# EAGLE design ShieldPotencia (EAGLE 7.2.0)
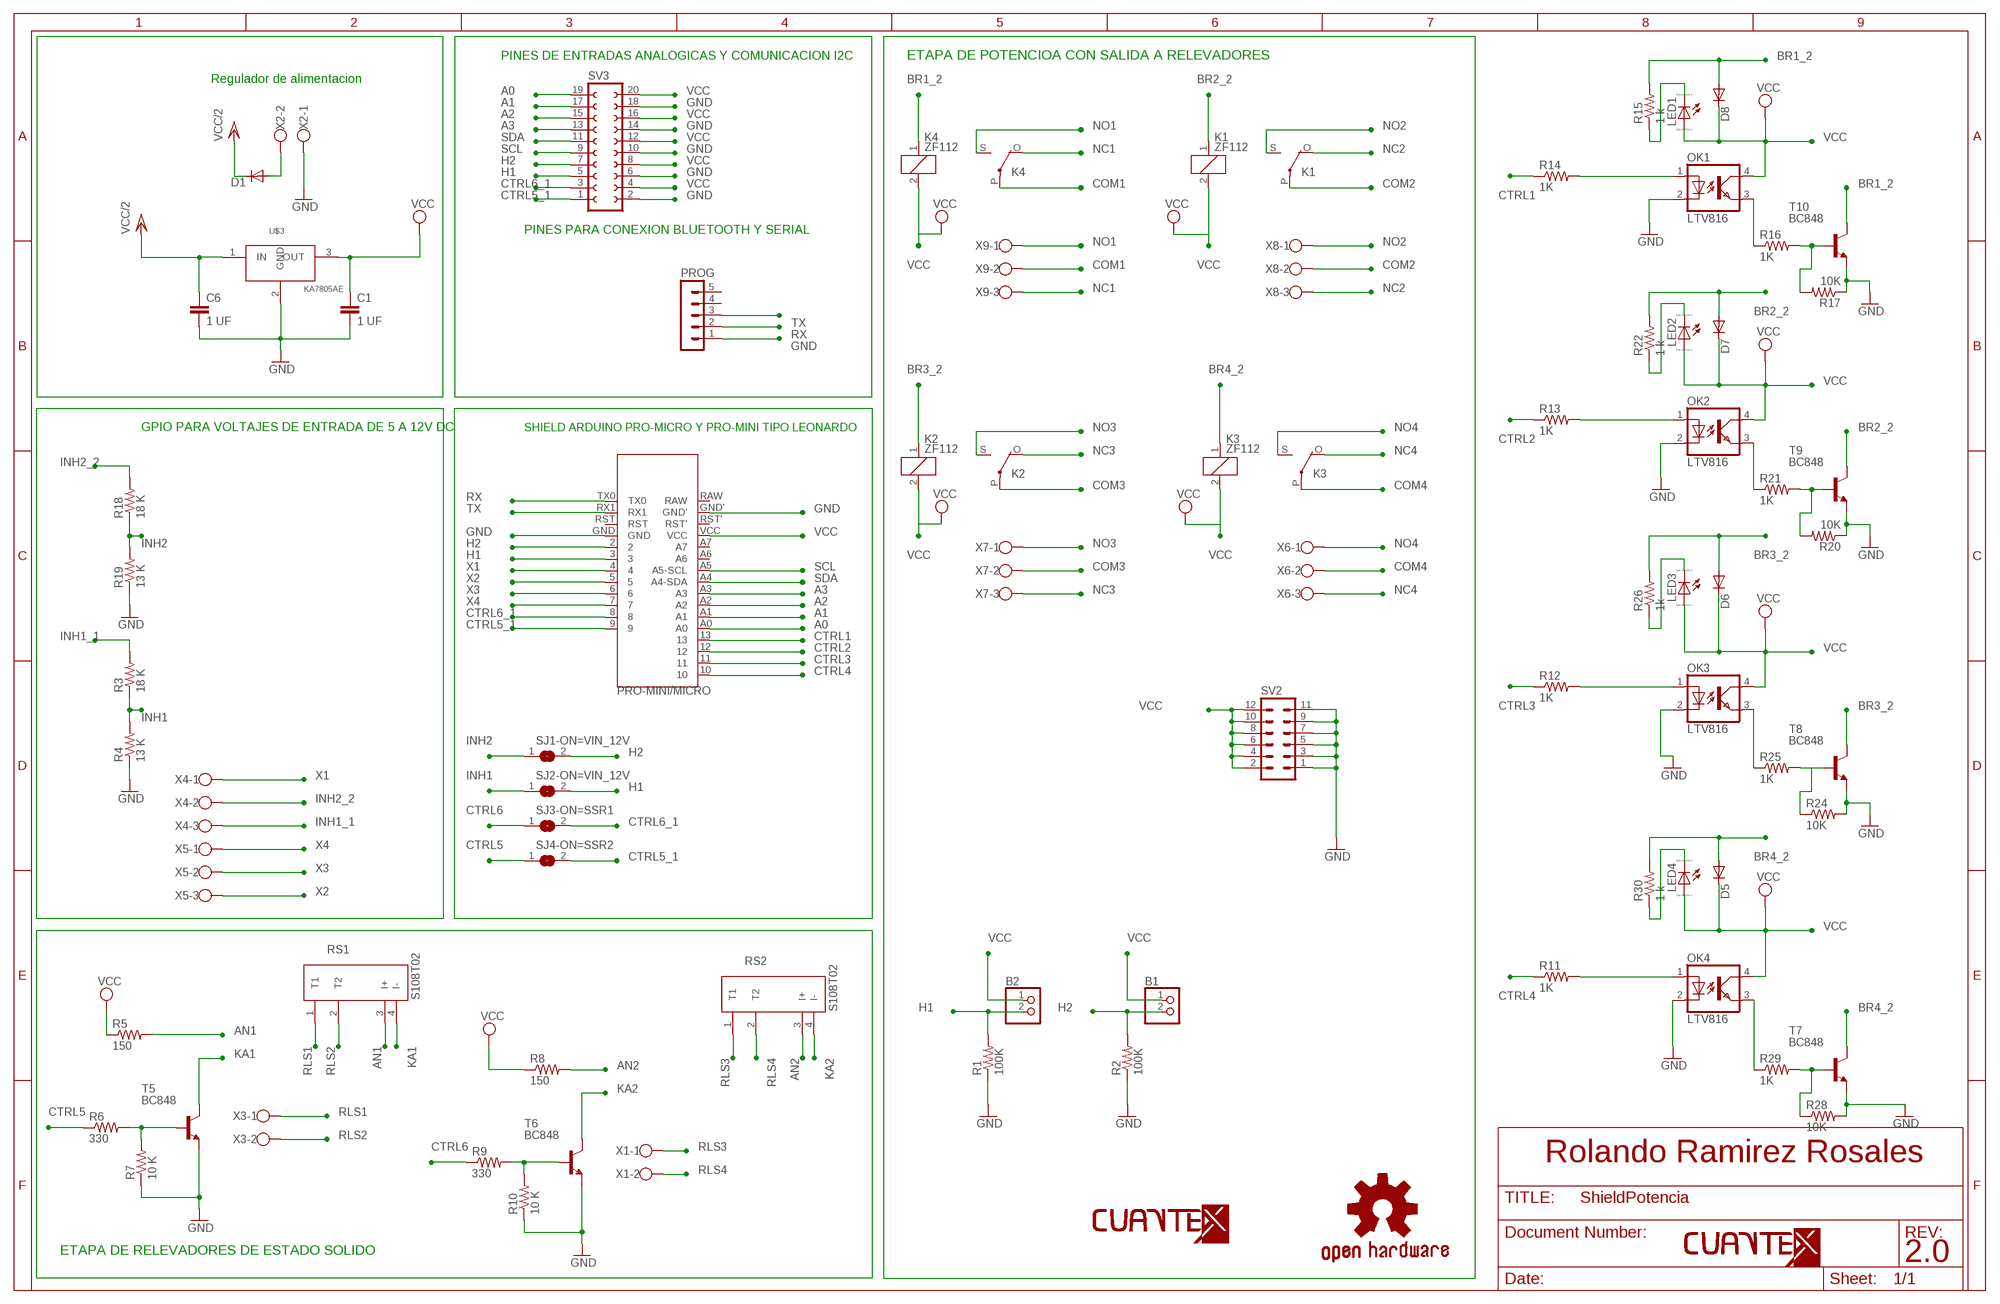
[diagram p0: schematic, sheet 1]

## Parts
B1  PINHD-1X2  [1X02]
B2  PINHD-1X2  [1X02]
C1  1 UF  C-EUC0603  [C0603]
C6  1 UF  C-EUC0603  [C0603]
D1  DIODE-SMB  [SMB]
D5  DIODE-SMB  [SMB]
D6  DIODE-SMB  [SMB]
D7  DIODE-SMB  [SMB]
D8  DIODE-SMB  [SMB]
GOLD_ORB_SM1  OSHWLOGO_GOLD_ORB_SM  [OSHW2]
K1  ZF112  [ZF112]
K2  ZF112  [ZF112]
K3  ZF112  [ZF112]
K4  ZF112  [ZF112]
LED1  LED_ESML0603  [LED_SML0603]
LED2  LED_ESML0603  [LED_SML0603]
LED3  LED_ESML0603  [LED_SML0603]
LED4  LED_ESML0603  [LED_SML0603]
OK1  LTV816  [DIL04]
OK2  LTV816  [DIL04]
OK3  LTV816  [DIL04]
OK4  LTV816  [DIL04]
PRO-MINI/MICRO  ARDUINO_PRO_MINI_V1  [ARDUINO_PRO_MINI_V1]
PROG  MA05-1  [MA05-1]
R1  100K  R-US_R0603  [R0603]
R2  100K  R-US_R0603  [R0603]
R3  18 K  R-US_R1206  [R1206]
R4  13 K  R-US_R1206  [R1206]
R5  150  R-US_R0603  [R0603]
R6  330  R-US_R0603  [R0603]
R7  10 K  R-US_R0603  [R0603]
R8  150  R-US_R0603  [R0603]
R9  330  R-US_R0603  [R0603]
R10  10 K  R-US_R0603  [R0603]
R11  1K  R-US_R0603  [R0603]
R12  1K  R-US_R0603  [R0603]
R13  1K  R-US_R0603  [R0603]
R14  1K  R-US_R0603  [R0603]
R15  1 k  R-US_R0603  [R0603]
R16  1K  R-US_R0603  [R0603]
R17  10K  R-US_R0603  [R0603]
R18  18 K  R-US_R1206  [R1206]
R19  13 K  R-US_R1206  [R1206]
R20  10K  R-US_R0603  [R0603]
R21  1K  R-US_R0603  [R0603]
R22  1 k  R-US_R0603  [R0603]
R24  10K  R-US_R0603  [R0603]
R25  1K  R-US_R0603  [R0603]
R26  1k  R-US_R0603  [R0603]
R28  10K  R-US_R0603  [R0603]
R29  1K  R-US_R0603  [R0603]
R30  1 k  R-US_R0603  [R0603]
RS1  S108T02  [SIP4PIN]
RS2  S108T02  [SIP4PIN]
SJ1-ON=VIN_12V  SJ  [SJ]
SJ2-ON=VIN_12V  SJ  [SJ]
SJ3-ON=SSR1  SJ  [SJ]
SJ4-ON=SSR2  SJ  [SJ]
SV2  MA06-2  [MA06-2]
SV3  FE10-2  [FE10-2]
T5  BC848  [SOT23]
T6  BC848  [SOT23]
T7  BC848  [SOT23]
T8  BC848  [SOT23]
T9  BC848  [SOT23]
T10  BC848  [SOT23]
U$1  LOGO-TOP-50MM  [C-3]
U$2  LOGO-TOP-20MM  [C-0]
U$3  KA7805AE  [DPAK]
X1  W237-102  [W237-102]
X2  W237-102  [W237-102]
X3  W237-102  [W237-102]
X4  W237-103  [W237-103]
X5  W237-103  [W237-103]
X6  W237-103  [W237-103]
X7  W237-103  [W237-103]
X8  W237-103  [W237-103]
X9  W237-103  [W237-103]

## Nets
A0: PRO-MINI/MICRO.A0 SV3.19
A1: PRO-MINI/MICRO.A1 SV3.17
A2: PRO-MINI/MICRO.A2 SV3.15
A3: PRO-MINI/MICRO.A3 SV3.13
AN1: R5.2 RS1.3(I+)
AN2: R8.2 RS2.3(I+)
BR1_2: D8.A K4.1 R15.2 T10.3(C)
BR2_2: D7.A K1.1 R22.2 T9.3(C)
BR3_2: D6.A K2.1 R26.2 T8.3(C)
BR4_2: D5.A K3.1 R30.2 T7.3(C)
COM1: K4.P(2:P) X9.2
COM2: K1.P(2:P) X8.2
COM3: K2.P(2:P) X7.2
COM4: K3.P(2:P) X6.2
CTRL1: PRO-MINI/MICRO.13 R14.1
CTRL2: PRO-MINI/MICRO.12 R13.1
CTRL3: PRO-MINI/MICRO.11 R12.1
CTRL4: PRO-MINI/MICRO.10 R11.1
CTRL5: R6.1 SJ4-ON=SSR2.1
CTRL5_1: PRO-MINI/MICRO.9 SJ4-ON=SSR2.2 SV3.1
CTRL6: R9.1 SJ3-ON=SSR1.1
CTRL6_1: PRO-MINI/MICRO.8 SJ3-ON=SSR1.2 SV3.3
GND: C1.2 C6.2 OK1.2(C) OK2.2(C) OK3.2(C) OK4.2(C) PRO-MINI/MICRO.GND PRO-MINI/MICRO.GND' PROG.1 R1.1 R2.1 R4.1 R7.1 R10.1 R17.1 R19.1 R20.1 R24.2 R28.2 SV2.1 SV2.3 SV2.5 SV2.7 SV2.9 SV2.11 SV3.2 SV3.6 SV3.10 SV3.14 SV3.18 T5.2(E) T6.2(E) T7.2(E) T8.2(E) T9.2(E) T10.2(E) U$3.2(GND) X2.1
H1: B2.2 PRO-MINI/MICRO.3 R1.2 SJ2-ON=VIN_12V.2 SV3.5
H2: B1.2 PRO-MINI/MICRO.2 R2.2 SJ1-ON=VIN_12V.2 SV3.7
INH1: R3.1 R4.2 SJ2-ON=VIN_12V.1
INH1_1: R3.2 X4.3
INH2: R18.1 R19.2 SJ1-ON=VIN_12V.1
INH2_2: R18.2 X4.2
KA1: RS1.4(I-) T5.3(C)
KA2: RS2.4(I-) T6.3(C)
N$4: OK2.1(A) R13.2
N$6: R9.2 R10.2 T6.1(B)
N$9: LED4.C R30.1
N$10: D1.A X2.2
N$12: OK4.1(A) R11.2
N$14: OK4.3(EMIT) R29.1
N$15: R28.1 R29.2 T7.1(B)
N$16: R24.1 R25.2 T8.1(B)
N$17: OK3.3(EMIT) R25.1
N$18: R20.2 R21.2 T9.1(B)
N$19: OK2.3(EMIT) R21.1
N$20: R16.2 R17.2 T10.1(B)
N$21: OK1.3(EMIT) R16.1
N$22: LED1.C R15.1
N$24: LED2.C R22.1
N$27: LED3.C R26.1
N$31: OK3.1(A) R12.2
N$43: OK1.1(A) R14.2
N$67: R6.2 R7.2 T5.1(B)
NC1: K4.O(2:O) X9.3
NC2: K1.O(2:O) X8.3
NC3: K2.O(2:O) X7.3
NC4: K3.O(2:O) X6.3
NO1: K4.S(2:S) X9.1
NO2: K1.S(2:S) X8.1
NO3: K2.S(2:S) X7.1
NO4: K3.S(2:S) X6.1
RLS1: RS1.1(T1) X3.1
RLS2: RS1.2(T2) X3.2
RLS3: RS2.1(T1) X1.1
RLS4: RS2.2(T2) X1.2
RX: PRO-MINI/MICRO.TX0 PROG.2
SCL: PRO-MINI/MICRO.A5(A5-SCL) SV3.9
SDA: PRO-MINI/MICRO.A4(A4-SDA) SV3.11
TX: PRO-MINI/MICRO.RX1 PROG.3
VCC: B1.1 B2.1 C1.1 D5.C D6.C D7.C D8.C K1.2 K2.2 K3.2 K4.2 LED1.A LED2.A LED3.A LED4.A OK1.4(COL) OK2.4(COL) OK3.4(COL) OK4.4(COL) PRO-MINI/MICRO.VCC R5.1 R8.1 SV2.2 SV2.4 SV2.6 SV2.8 SV2.10 SV2.12 SV3.4 SV3.8 SV3.12 SV3.16 SV3.20 U$3.3(OUT)
VCC/2: C6.1 D1.C U$3.1(IN)
X1: PRO-MINI/MICRO.4 X4.1
X2: PRO-MINI/MICRO.5 X5.3
X3: PRO-MINI/MICRO.6 X5.2
X4: PRO-MINI/MICRO.7 X5.1
Unconnected: PRO-MINI/MICRO.A6 PRO-MINI/MICRO.A7 PRO-MINI/MICRO.RAW PRO-MINI/MICRO.RST PRO-MINI/MICRO.RST' PROG.4 PROG.5

## Notes on the sheet
- PINES DE ENTRADAS ANALOGICAS Y COMUNICACION I2C | ETAPA DE POTENCIOA CON SALIDA A RELEVADORES
- Regulador de alimentacion
- PINES PARA CONEXION BLUETOOTH Y SERIAL
- GPIO PARA VOLTAJES DE ENTRADA DE 5 A 12V DC | SHIELD ARDUINO PRO-MICRO Y PRO-MINI TIPO LEONARDO
- Rolando Ramirez Rosales
- ETAPA DE RELEVADORES DE ESTADO SOLIDO
- 2.0

## Library data of the parts
B1 B2 = pinhead:PINHD-1X2: PIN HEADER
C1 C6 = rcl:C-EU: CAPACITOR, European symbol
D1 D5-D8 = diode:DIODE-: DIODE
GOLD_ORB_SM1 = OPENHW:OSHWLOGO: These are Open-Source Hardware logos.
K1-K4 = relay:ZF112: RELAY 1 x switch; OC_FARNELL: unknown; OC_NEWARK: unknown
LED1-LED4 = eagle-ltspice:LED_E: LED Source: http://www.osram.convergy.de Source: www.luxeon.com Source: www.kingbright.com; SPICEMODEL: NONE; SPICEPREFIX: D; SPICETYPE: diode
OK1-OK4 = optocoupler:LTV816: OPTO COUPLER Source: LITEON, LTV816.pdf; OC_FARNELL: unknown; OC_NEWARK: unknown
PRO-MINI/MICRO = Arduino_Pro_Mini:ARDUINO_PRO_MINI_V1
PROG = con-lstb:MA05-1: PIN HEADER; OC_FARNELL: unknown; OC_NEWARK: unknown
R1-R22 R24-R26 R28-R30 = rcl:R-US_: RESISTOR, American symbol
RS1 RS2 = SSRHETPRO:S108T02
SJ1-ON=VIN_12V SJ2-ON=VIN_12V SJ3-ON=SSR1 SJ4-ON=SSR2 = jumper:SJ: SMD solder JUMPER
SV2 = con-lstb:MA06-2: PIN HEADER; OC_FARNELL: unknown; OC_NEWARK: unknown
SV3 = con-lsta:FE10-2: FEMALE HEADER; OC_FARNELL: unknown; OC_NEWARK: unknown
T5-T10 = transistor-neu-to92:BC848: NPN TRANSISTOR
U$1 = LOGOTIPOS:LOGO-TOP-50MM
U$2 = LOGOTIPOS:LOGO-TOP-20MM
U$3 = Regulador5VKA7805AE:KA7805AE: Regulador de voltaje 5V ing.roland.ramirez@gmail.com
X1-X3 = con-wago-500:W237-102: WAGO SCREW CLAMP; MPN: 237-102; OC_FARNELL: unknown; OC_NEWARK: 70K9898
X4-X9 = con-wago-500:W237-103: WAGO SCREW CLAMP; MPN: 237-103; OC_FARNELL: unknown; OC_NEWARK: 18M7116

## Board
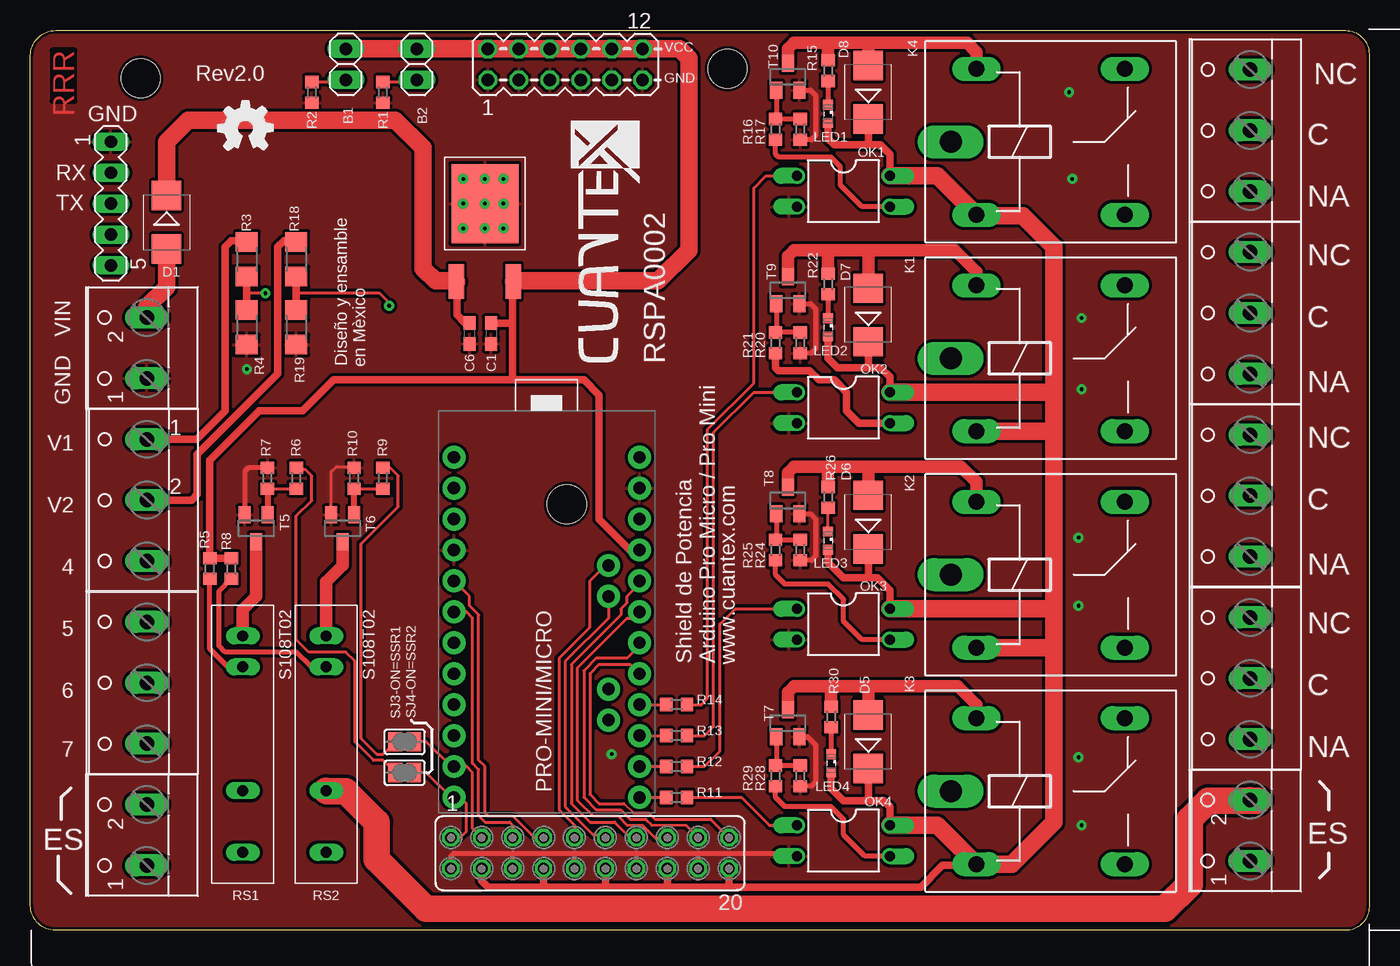
[diagram p1: board, top side]
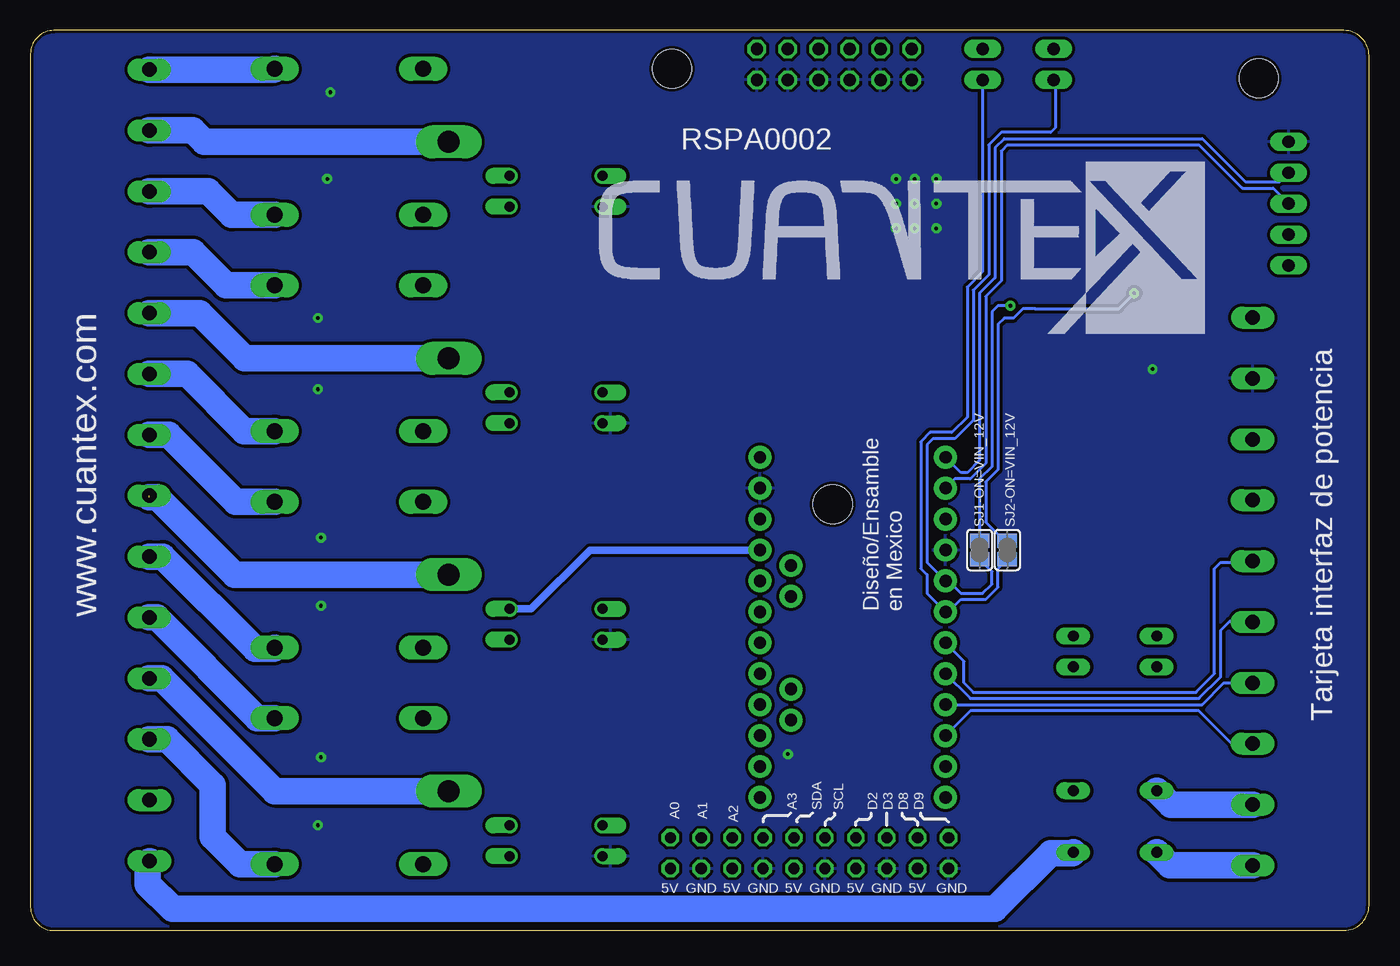
[diagram p2: board, bottom side, seen from below]

Size 109.98 x 73.91 mm. Coordinates in mm from the lower left corner, seen from the top.
Outline: 108.06,0 2.06,0 arc-90 0,2.06 0,71.85 arc-90 2.07,73.91 108.06,73.91 arc-90 109.98,71.99 109.98,1.92 arc-90 108.06,0
Copper layers (1*16): Top 0.035mm / dielectric 1.5mm / Bottom 0.035mm
Design rules "cuantex2layerdrc": minimum track width 8mil, minimum drill 0.3mm, track to track 8mil, track to pad 8mil, pad to pad 8mil, via to via 8mil, smd to smd 0mil, copper to edge 10mil, drill to drill 10mil, minimum pad ring 10mil, minimum via ring 10mil, stop-mask expansion 4mil, vias tented up to drill 0mil, thermal gap 10mil
Holes 3.2 mm at 9.06,70 57.27,70.76 44.06,35

### Footprints (pad centres in the part's own frame; a part is rotated, then mirrored left to right if it is on the bottom)
1X02 = drill 1.016 long: 1 -1.27,0; 2 1.27,0
C0603 = smd 1.1 x 1: 1 -0.85,0; 2 0.85,0
SMB = smd 2.4 x 2.4: A 2.2,0; C -2.2,0
ZF112 = drill 1.321 long: 1 -6.096,5.994; 2 -6.096,-5.994; O 6.096,5.994; S 6.096,-5.994 | drill 1.803 long: P -8.204,0
LED_SML0603 = smd 0.8 x 0.8: A 0.75,0; C -0.75,0
DIL04 = drill 0.813 offset: 1 -1.27,-3.81; 2 1.27,-3.81; 3 1.27,3.81; 4 -1.27,3.81
ARDUINO_PRO_MINI_V1 = drill 1.016 pad 1.88: 2 -7.62,2.54; 3 -7.62,0; 4 -7.62,-2.54; 5 -7.62,-5.08; 6 -7.62,-7.62; 7 -7.62,-10.16; 8 -7.62,-12.7; 9 -7.62,-15.24; 10 7.62,-15.24; 11 7.62,-12.7; 12 7.62,-10.16; 13 7.62,-7.62; A0 7.62,-5.08; A1 7.62,-2.54; A2 7.62,0; A3 7.62,2.54; A4 5.08,1.27; A5 5.08,3.81; A6 5.08,-8.89; A7 5.08,-6.35; GND -7.62,5.08; GND' 7.62,10.16; RAW 7.62,12.7; RST -7.62,7.62; RST' 7.62,7.62; RX1 -7.62,10.16; TX0 -7.62,12.7; VCC 7.62,5.08
MA05-1 = drill 1.016 long: 1 -5.08,0; 2 -2.54,0; 3 0,0; 4 2.54,0; 5 5.08,0
R0603 = smd 1 x 1.1: 1 -0.85,0; 2 0.85,0
R1206 = smd 1.6 x 1.803: 1 -1.422,0; 2 1.422,0
SIP4PIN = drill 0.9 long: 1 -10.16,0; 2 -5.08,0; 3 5.08,0; 4 7.62,0
SJ = smd 1.168 x 1.6: 1 -0.762,0; 2 0.762,0
MA06-2 = drill 1.016 octagon: 1 -6.35,-1.27; 2 -6.35,1.27; 3 -3.81,-1.27; 4 -3.81,1.27; 5 -1.27,-1.27; 6 -1.27,1.27; 7 1.27,-1.27; 8 1.27,1.27; 9 3.81,-1.27; 10 3.81,1.27; 11 6.35,-1.27; 12 6.35,1.27
FE10-2 = drill 0.914 octagon: 1 -11.43,1.27; 2 -11.43,-1.27; 3 -8.89,1.27; 4 -8.89,-1.27; 5 -6.35,1.27; 6 -6.35,-1.27; 7 -3.81,1.27; 8 -3.81,-1.27; 9 -1.27,1.27; 10 -1.27,-1.27; 11 1.27,1.27; 12 1.27,-1.27; 13 3.81,1.27; 14 3.81,-1.27; 15 6.35,1.27; 16 6.35,-1.27; 17 8.89,1.27; 18 8.89,-1.27; 19 11.43,1.27; 20 11.43,-1.27
SOT23 = smd 1 x 1.4: 1 -0.95,-1.1; 2 0.95,-1.1; 3 0,1.1
DPAK = smd 1.25 x 2.85: 1 -2.34,-6.4; 3 2.34,-6.4 | smd 5.5 x 6.5: 2 0,0
W237-102 = drill 1.194 long: 1 -2.5,-1.27; 2 2.5,-1.27
W237-103 = drill 1.194 long: 1 -5,-1.29; 2 0,-1.29; 3 5,-1.29

### Placement (x,y rotation side)
B1  25.91,71.12 270 top
B2  31.75,71.12 270 top
C1  37.85,49.02 270 top
C6  36.07,49.02 270 top
D1  11.18,58.17 270 top
D5  68.83,15.49 90 top
D6  68.83,33.53 90 top
D7  68.83,50.55 90 top
D8  68.83,68.83 90 top
GOLD_ORB_SM1  13.84,61.59 0 top
K1  83.82,46.99 0 top
K2  83.82,29.21 0 top
K3  83.82,11.43 0 top
K4  83.82,64.77 0 top
LED1  65.53,67.06 270 top
LED2  65.53,49.53 270 top
LED3  65.53,32 270 top
LED4  65.79,13.72 270 top
OK1  66.8,60.71 270 top
OK2  66.8,42.93 270 top
OK3  66.8,25.15 270 top
OK4  66.8,7.37 270 top
PRO-MINI/MICRO  42.42,26.16 0 top
PROG  6.6,59.69 270 top
R1  28.96,68.83 90 top
R2  23.11,68.83 90 top
R3  17.78,55.12 90 top
R4  17.78,49.53 90 top
R5  14.73,29.72 270 top
R6  21.84,37.13 270 top
R7  19.48,37.13 270 top
R8  16.51,29.72 270 top
R9  28.96,37.13 270 top
R10  26.59,37.13 270 top
R11  53.09,10.92 0 top
R12  53.09,13.46 0 top
R13  53.09,16 0 top
R14  53.09,18.54 0 top
R15  65.53,70.61 90 top
R16  61.21,65.79 90 top
R17  63.25,65.79 90 top
R18  21.84,55.12 90 top
R19  21.84,49.53 90 top
R20  63.25,48.26 90 top
R21  61.21,48.26 90 top
R22  65.53,53.09 90 top
R24  63.25,31.24 270 top
R25  61.21,31.24 90 top
R26  65.53,35.56 90 top
R28  63.25,12.7 270 top
R29  61.21,12.7 90 top
R30  65.79,17.53 90 top
RS1  17.45,16.56 90 top
RS2  24.31,16.56 90 top
SJ1-ON=VIN_12V  32,31.24 270 bottom
SJ2-ON=VIN_12V  29.72,31.24 270 bottom
SJ3-ON=SSR1  30.73,15.49 0 top
SJ4-ON=SSR2  30.73,12.95 0 top
SV2  43.94,71.12 0 top
SV3  45.97,6.35 0 top
T5  18.54,33.02 180 top
T6  25.65,33.02 180 top
T7  62.23,17.02 0 top
T8  62.23,35.31 0 top
T9  62.23,52.58 0 top
T10  62.23,70.1 0 top
U$1  63.37,48.9 0 bottom
U$2  50.09,46.61 90 top
U$3  37.34,59.69 0 top
X1  98.93,8.2 90 top
X2  8.29,47.83 90 top
X3  8.29,7.83 90 top
X4  8.29,35.33 90 top
X5  8.29,20.33 90 top
X6  98.93,20.7 90 top
X7  98.93,35.7 90 top
X8  98.93,50.7 90 top
X9  98.93,65.7 90 top

### Tracks (layer width: path | path; a pad name or v marks a point on that pad's centre or on a via)
A0
  Top 0.203: 48.77,10.41 49.53,9.65
  Top 0.254: PRO-MINI/MICRO.A0 49.28,21.84 46.74,21.84 45.97,21.08 45.97,11.18 46.74,10.41 48.77,10.41 | 49.53,9.65 50.8,9.65 51.31,9.14 55.88,9.14 SV3.19
A1
  Top 0.203: 51.05,8.64 53.85,8.64
  Top 0.254: PRO-MINI/MICRO.A1 50.04,23.37 49.02,22.35 46.48,22.35 45.47,21.34 45.47,10.92 46.48,9.91 48.51,9.91 49.28,9.14 50.55,9.14 51.05,8.64 | 53.85,8.64 SV3.17
A2
  Top 0.203: 49.02,8.64 50.29,8.64
  Top 0.254: PRO-MINI/MICRO.A2 49.53,25.65 49.02,25.65 44.96,21.59 44.96,10.67 46.23,9.4 48.26,9.4 49.02,8.64 | 50.29,8.64 51.31,7.62 SV3.15
A3
  Top 0.254: PRO-MINI/MICRO.A3 50.04,28.45 49.02,27.43 49.02,26.92 48.51,26.42 48.51,25.91 44.45,21.84 44.45,10.41 45.97,8.89 48.01,8.89 49.02,7.87 49.53,7.87 SV3.13
AN1
  Top 0.406: RS1.3 16.2,21.64 14.73,23.11 R5.2
AN2
  Top 0.406: RS2.3 23.06,21.64 21.84,22.86 16,22.86 15.49,23.37 15.49,27.85 R8.2
BR1_2
  Top 1.016: K4.1 77.72,72.14 76.96,72.9 68.58,72.9 | 68.58,72.9 65.53,72.9 | 65.53,72.9 62.74,72.9 62.23,72.39 T10.3 | D8.A 68.83,72.64 68.58,72.9 | R15.2 65.53,72.9
BR2_2
  Top 1.016: K1.1 77.72,54.1 75.95,55.88 69.09,55.88 | 69.09,55.88 65.79,55.88 | 65.79,55.88 62.74,55.88 62.23,55.37 T9.3 | D7.A 68.83,55.63 69.09,55.88 | R22.2 65.53,55.63 65.79,55.88
BR3_2
  Top 1.016: K2.1 77.72,36.83 76.45,38.1 68.58,38.1 | 68.58,38.1 65.53,38.1 | 65.53,38.1 62.74,38.1 62.23,37.59 T8.3 | R26.2 65.53,38.1 | D6.A 68.83,37.85 68.58,38.1
BR4_2
  Top 1.016: K3.1 77.72,18.54 76.2,20.07 68.83,20.07 | 68.83,20.07 66.04,20.07 | 66.04,20.07 62.74,20.07 62.23,19.56 T7.3 | R30.2 65.79,19.81 66.04,20.07 | D5.A 68.83,20.07
COM1
  Bottom 2.184: K4.P 95.71,64.77 96.65,65.71 100.21,65.71 X9.2
COM2
  Bottom 2.184: K1.P 92.38,46.99 96.09,50.7 X8.2
COM3  (1 unrouted)
  Bottom 2.184: 100.22,35.56 99.57,35.56 93.22,29.21 K2.P
COM4
  Bottom 2.184: X6.2 99.19,20.7 89.92,11.43 K3.P
CTRL1
  Top 0.254: PRO-MINI/MICRO.13 R14.1
CTRL2
  Top 0.254: PRO-MINI/MICRO.12 R13.1
CTRL3
  Top 0.254: PRO-MINI/MICRO.11 R12.1
CTRL4
  Top 0.254: PRO-MINI/MICRO.10 R11.1
CTRL5
  Top 0.254: 21.86,38 R6.1 21.98,37.85 22.61,37.85 23.11,37.34 23.11,35.31 21.84,34.04 21.84,23.88 22.86,22.86 25.91,22.86 26.67,22.1 26.67,15.49 28.19,13.97 28.96,13.97 SJ4-ON=SSR2.1
CTRL5_1
  Top 0.254: SJ4-ON=SSR2.2 32.51,12.95 34.54,10.92 PRO-MINI/MICRO.9 35.31,10.92 35.81,10.41 35.81,8.13 35.31,7.62 SV3.1
CTRL6
  Top 0.254: 28.97,38 R9.1 29.07,38.1 29.46,38.1 30.23,37.34 30.23,34.8 27.18,31.75 27.18,15.75 28.45,14.48 28.96,14.48 SJ3-ON=SSR1.1
CTRL6_1
  Top 0.254: SJ3-ON=SSR1.2 32.51,15.49 34.54,13.46 PRO-MINI/MICRO.8 35.81,13.46 36.32,12.95 36.32,8.38 SV3.3
GND  (via drill 0.3)
  Top 0.254: T6.2 24.7,37.66 25.15,38.1 26.48,38.1 R10.1
  Top 0.406: R7.1 17.89,37.98 17.6,37.69 T5.2 | T10.2 64.09,69 64.52,68.58 64.52,65.28 64.17,64.94 R17.1 | T9.2 64.09,51.48 64.52,51.05 64.52,47.75 64.17,47.41 R20.1 | T8.2 64.09,34.21 64.52,33.78 64.52,30.73 64.17,30.39 R24.2 | T7.2 63.84,15.92 64.52,15.24 64.52,12.19 64.17,11.85 R28.2 | SV3.2 34.54,6.1 34.8,6.35 39.62,6.35 | 39.62,6.35 44.7,6.35 | 44.7,6.35 49.78,6.35 | 49.78,6.35 54.86,6.35 | 54.86,6.35 62.74,6.35 OK4.2 | SV3.6 39.62,6.35 | SV3.10 44.7,6.35 | SV3.14 49.78,6.35 | SV3.18 54.86,6.35
  other vias: 35.56,61.72 35.56,59.69 35.56,57.66 38.86,61.72 38.86,59.69 38.86,57.66 37.34,61.72 37.34,59.69 37.34,57.66 17.78,46.1 86.11,32.26 86.11,26.67 86.11,14.22 86.36,8.64 86.36,44.45 86.36,50.29 85.6,61.72 85.34,68.83 47.75,14.48
  pour Bottom (isolate 0.254): 0.06,74 109.94,74.25 109.94,0.25 0.06,0
  pour Top (isolate 0.254): 0.06,0 0.06,74 109.94,74 109.94,0
H1
  Top 0.254: PRO-MINI/MICRO.3 35.81,26.16 36.32,25.65 36.32,13.72 36.83,13.21 36.83,9.4 37.34,8.89 39.37,8.89 39.62,8.64 SV3.5 | R1.2 31.58,69.68 B2.2
  Bottom 0.254: SJ2-ON=VIN_12V.2 30.48,29.72 30.48,28.19 31.5,27.18 33.53,27.18 34.54,26.16 PRO-MINI/MICRO.3 36.32,27.69 36.32,29.21 36.83,29.72 36.83,40.13 36.07,40.89 34.29,40.89 33.02,42.16 33.02,52.83 31.75,54.1 B2.2
H2
  Top 0.254: PRO-MINI/MICRO.2 36.07,27.43 36.07,26.67 36.83,25.91 36.83,13.97 37.34,13.46 37.34,9.65 37.59,9.4 39.62,9.4 41.4,7.62 SV3.7 | R2.2 25.74,69.68 B1.2
  Bottom 0.254: SJ1-ON=VIN_12V.2 30.99,29.46 30.99,28.45 31.75,27.69 33.53,27.69 34.54,28.7 PRO-MINI/MICRO.2 36.32,30.23 36.32,39.88 35.81,40.39 34.04,40.39 32.51,41.91 32.51,52.58 31.24,53.85 31.24,64.52 30.23,65.53 26.16,65.53 25.74,65.95 25.74,69.68 B1.2
INH1  (via drill 0.3)
  Top 0.254: v19.3,52.32 17.78,52.32
  Top 0.61: R4.2 17.78,52.32 R3.1
  Bottom 0.254: SJ2-ON=VIN_12V.1 29.97,32.26 30.23,32.26 31.5,33.53 31.5,36.83 30.48,37.85 30.48,49.78 29.97,50.29 29.21,50.29 28.45,51.05 27.43,51.05 20.57,51.05 v19.3,52.32
INH1_1
  Top 0.61: X4.3 13.66,40.33 16,42.67 16,56.13 16.51,56.64 17.68,56.64 R3.2
INH2  (via drill 0.3)
  Top 0.254: v29.46,51.31 29.46,51.56 28.7,52.32 21.84,52.32
  Top 0.61: R19.2 21.84,52.32 R18.1
  Bottom 0.254: v29.46,51.31 30.48,51.31 30.99,50.8 30.99,38.1 32,37.08 SJ1-ON=VIN_12V.1
INH2_2
  Top 0.61: X4.2 13.24,35.33 13.72,35.81 13.72,39.12 20.32,45.72 20.32,56.13 20.83,56.64 21.74,56.64 R18.2
KA1
  Top 1.016: RS1.4 17.45,26.34 18.54,27.43 T5.3
KA2
  Top 1.016: RS2.4 24.31,28.63 25.65,29.97 T6.3
N$4
  Top 0.254: R13.2 55.37,16 56.13,16.76 56.13,40.89 59.44,44.2 OK2.1
N$6
  Top 0.254: R10.2 R9.2
  Top 0.508: T6.1 R10.2
N$9
  Top 0.406: R30.1 LED4.C
N$10
  Top 1.422: X2.2 9.56,51.21 11.18,52.83 D1.A
N$12
  Top 0.254: R11.2 58.42,10.92 60.71,8.64 OK4.1
N$14
  Top 0.406: OK4.3 68.58,6.1 66.8,7.87 66.8,9.14 65.79,10.16 61.98,10.16 61.21,10.92 R29.1
N$15
  Top 0.406: T7.1 61.28,13.62 R29.2 R28.1
N$16
  Top 0.406: T8.1 61.28,32.16 R25.2 R24.1
N$17
  Top 0.406: OK3.3 68.33,23.88 66.8,25.4 66.8,27.18 65.53,28.45 61.98,28.45 61.21,29.21 R25.1
N$18
  Top 0.406: T9.1 61.28,49.18 R21.2 R20.2
N$19
  Top 0.61: OK2.3 68.07,41.66 67.06,42.67 67.06,44.2 66.04,45.21 64.77,45.21 64.01,45.97 61.47,45.97 61.21,46.23 R21.1 61.21,47.5
N$20
  Top 0.406: T10.1 61.28,66.7 R16.2 R17.2
N$21
  Top 0.406: OK1.3 68.33,59.44 66.55,61.21 66.55,62.74 65.79,63.5 61.47,63.5 61.21,63.75 R16.1
N$22
  Top 0.406: R15.1 LED1.C
N$24
  Top 0.406: R22.1 LED2.C
N$27
  Top 0.254: LED3.C R26.1
N$31
  Top 0.254: R12.2 55.37,13.46 56.64,14.73 56.64,25.15 57.91,26.42 OK3.1
N$43
  Top 0.254: R14.2 55.12,18.54 55.63,19.05 55.63,41.15 59.44,44.96 59.44,60.96 60.45,61.98 OK1.1
N$67
  Top 0.254: R7.2 R6.2
  Top 0.508: R7.2 19.48,34.13 T5.1
NC1
  Bottom 2.184: X9.3 89.98,70.7 K4.O
NC2
  Bottom 2.184: K1.O 93.9,52.98 96.62,55.7 X8.3
NC3
  Bottom 2.184: X7.3 98.61,40.7 93.12,35.2 K2.O
NC4
  Bottom 2.184: X6.3 99.61,25.7 91.34,17.42 K3.O
NO1
  Bottom 2.184: K4.S 93.45,58.78 95.38,60.71 X9.1
NO2
  Bottom 2.184: X8.1 97.11,45.7 92.41,41 K1.S
NO3
  Bottom 2.184: X7.1 99.1,30.7 91.52,23.11 90.02,23.11 K2.S
NO4
  Bottom 2.184: X6.1 98.76,15.7 95,11.94 95,7.7 92.74,5.44 K3.S
RLS1
  Bottom 2.184: X3.1 16.38,5.33 RS1.1
RLS2
  Bottom 2.184: X3.2 16.3,10.33 RS1.2
RLS3
  Bottom 2.184: RS2.1 24.36,6.35 26.16,6.35 30.73,1.78 98.3,1.78 100.33,3.81 100.33,5.57 X1.1
RLS4
  Top 2.184: RS2.2 24.36,11.43 25.91,11.43 28.45,8.89 28.45,5.84 32.51,1.78 93.22,1.78 95.25,3.81 95.25,9.14 96.77,10.67 100.23,10.67 | 100.84,10.67 100.23,10.67 | 100.23,10.67 X1.2
RX
  Bottom 0.254: PRO-MINI/MICRO.TX0 33.53,37.59 33.02,37.59 32,38.61 32,52.32 30.73,53.59 30.73,64.26 29.97,65.02 13.72,65.02 10.16,61.47 7.37,61.47 PROG.2
SCL
  Top 0.254: PRO-MINI/MICRO.A5 47.24,29.97 45.97,28.7 45.97,24.89 43.43,22.35 43.43,9.91 44.7,8.64 SV3.9
SDA
  Top 0.254: PRO-MINI/MICRO.A4 47.5,25.65 43.94,22.1 43.94,10.16 46.23,7.87 46.99,7.87 SV3.11
TX
  Bottom 0.254: PRO-MINI/MICRO.RX1 34.04,37.08 32.77,37.08 31.5,38.35 31.5,52.07 30.23,53.34 30.23,64.01 29.72,64.52 13.97,64.52 10.41,60.96 7.87,60.96 PROG.3
VCC
  Top 0.61: 39.62,45.21 39.62,50.04 | 39.62,50.04 39.62,53.24 U$3.3 | C1.1 39.46,49.87 39.62,50.04 | LED1.A 65.53,65.02 66.04,64.52 68.83,64.52 | 68.83,64.52 69.85,64.52 70.61,63.75 OK1.4 | D8.C 68.83,64.52 | LED2.A 65.53,46.99 66.29,46.23 68.83,46.23 | 68.83,46.23 69.85,46.23 70.61,45.47 OK2.4 | D7.C 68.83,46.23 | LED3.A 65.53,30.23 66.8,28.96 68.83,28.96 | 68.83,28.96 69.6,28.96 70.61,27.94 OK3.4 | D6.C 68.83,28.96 | LED4.A 65.79,11.68 66.8,10.67 68.83,10.67 | 68.83,10.67 70.1,10.67 70.61,10.16 OK4.4 | D5.C 68.83,10.67 | R8.1 R5.1 14.73,38.61 18.8,42.67 22.35,42.67 24.89,45.21 39.62,45.21 | PRO-MINI/MICRO.VCC 49.28,31.24 46.74,33.78 46.74,43.94 45.47,45.21 39.62,45.21 | SV3.4 37.08,4.06 37.59,3.56 42.16,3.56 | 42.16,3.56 47.24,3.56 | 47.24,3.56 52.32,3.56 | 52.32,3.56 57.4,3.56 | 57.4,3.56 73.15,3.56 74.93,5.33 77.62,5.33 K3.2 | SV3.8 42.16,3.56 | SV3.20 57.4,3.56 | SV3.16 52.32,3.56 | SV3.12 47.24,3.56
  Top 1.422: 84.07,23.37 84.07,8.89 80.62,5.44 K3.2 74.52,8.64 OK4.4 | 84.07,23.37 84.07,26.67 | 84.07,26.67 84.07,40.89 | 84.07,40.89 84.07,44.2 | 84.07,44.2 84.07,56.13 81.53,58.67 77.83,58.67 K4.2 74.52,61.98 OK1.4 | OK2.4 84.07,44.2 | K1.2 83.97,41 84.07,40.89 | K2.2 83.92,23.22 84.07,23.37 | OK3.4 83.82,26.42 84.07,26.67 | U$3.3 39.73,53.34 51.56,53.34 54.1,55.88 54.1,71.63 53.34,72.39 SV2.12 SV2.10 SV2.8 SV2.6 SV2.4 SV2.2 B2.1 B1.1
  Bottom 0.61: PRO-MINI/MICRO.VCC 64.01,31.24 68.83,26.42 OK3.4
VCC/2
  Top 0.61: C6.1 35.73,49.87 35.05,50.55 35.05,53.24 U$3.1
  Top 1.422: U$3.1 34.95,53.34 33.27,53.34 32.26,54.36 32.26,64.26 29.97,66.55 12.95,66.55 11.18,64.77 D1.C
X1
  Bottom 0.254: X4.1 9.69,30.23 12.19,30.23 12.7,29.72 12.7,21.08 14.22,19.56 32.51,19.56 33.27,20.32 33.27,22.1 PRO-MINI/MICRO.4
X2
  Bottom 0.254: X5.3 9.64,25.4 11.43,25.4 12.19,24.64 12.19,20.83 13.97,19.05 32.77,19.05 PRO-MINI/MICRO.5
X3
  Bottom 0.254: PRO-MINI/MICRO.6 13.72,18.54 11.94,20.32 9.59,20.32 X5.2
X4
  Bottom 0.254: X5.1 11.27,15.33 13.97,18.03 32.77,18.03 PRO-MINI/MICRO.7

### Text on the board
Top: RRR
tPlace: Rev2.0 | NC | C | NA | NC | C | RSPA0002 | NA | NC | C | NA | NC | Shield de Potencia / Arduino Pro Micro / Pro Mini | www.cuantex.com | C | NA | ES | ES
bPlace: RSPA0002 | Tarjeta interfaz de potencia | Diseño/Ensamble / en Mexico | www.cuantex.com
tNames: VCC | GND | GND | RX | TX | VIN | Diseño y ensamble | en Mèxico | GND | V1 | 1 | V2 | 2 | 4 | 5 | 6 | 7
bNames: D9 | D8 | D3 | D2 | SCL | SDA | A3 | A2 | A1 | A0 | GND | 5V | GND | 5V | GND | 5V | GND | 5V | GND | 5V